# Altium schematic sheet ignition.SchDoc
size A; SheetNumber: 2; SheetTotal: 2
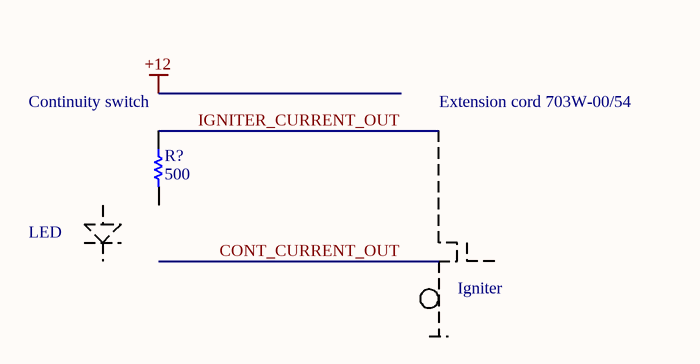
[diagram p0: ignition.SchDoc]

## Parts
R?  500  [R0603]

## Nets
IGNITER_CURRENT_OUT: R?.1

Not connected (* = marked no-connect by the designer): R? 2

## Notes on the sheet
- (near R?) Continuity switch
- Extension cord 703W-00/54
- LED
- Igniter

## Library data of the parts
R? = R0603: RESISTOR 0603; Value: 500